# Altium schematic sheet Flight Controller Schematics.schdoc
size 315 x 259 mm
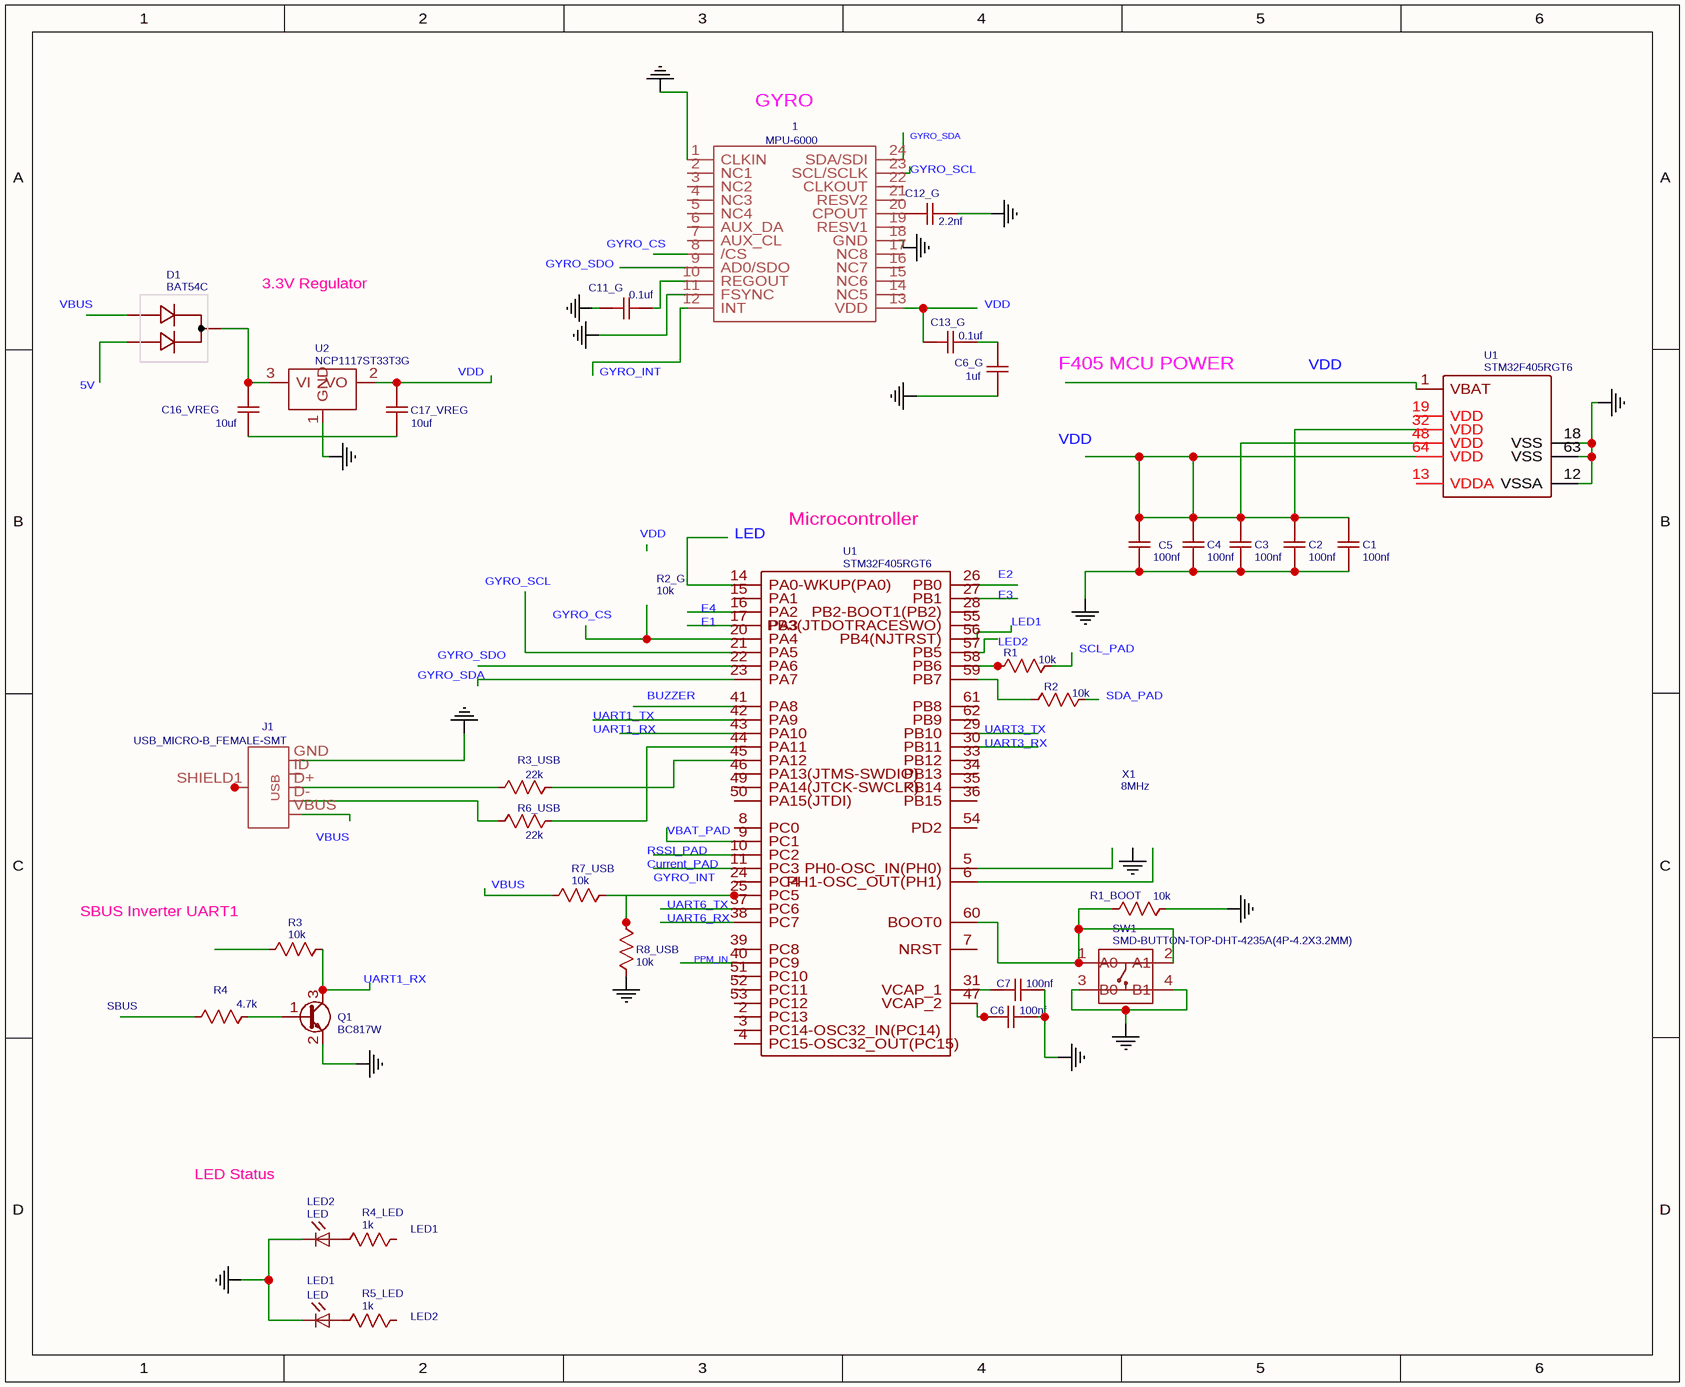
[diagram p0: Flight Controller Schematics.schdoc]

## Parts
(Parts that share a designator on the sheet are numbered #1, #2 ... from top to bottom, then left to right.)
1  MPU-6000  [QFN-24]
C1  100nf  [C0805]
C2  100nf  [C0805]
C3  100nf  [C0805]
C4  100nf  [C0805]
C5  100nf  [C0805]
C6  100nf  [C0805]
C6_G  1uf  [C0805]
C7  100nf  [C0805]
C11_G  0.1uf  [C0805]
C12_G  2.2nf  [C0805]
C13_G  0.1uf  [C0805]
C16_VREG  10uf  [C0805]
C17_VREG  10uf  [C0805]
D1  BAT54C  [SOT-23(SOT-23-3)]
J1  USB_MICRO-B_FEMALE-SMT  [USB-B-MICRO-SMD]
LED1  LED  [LED_CHIPLED_0805]
LED2  LED  [LED_CHIPLED_0805]
Q1  BC817W  [SOT-323_SC-70]
R1  10k  [R0402]
R1_BOOT  10k  [R0402]
R2  10k  [R0402]
R2_G  10k  [0402]
R3  10k  [R0402]
R3_USB  22k  [R0201]
R4  4.7k  [R0402]
R4_LED  1k  [R0402]
R5_LED  1k  [R0402]
R6_USB  22k  [R0201]
R7_USB  10k  [R0201]
R8_USB  10k  [R0201]
SW1  SMD-BUTTON-TOP-DHT-4235A(4P-4.2X3.2MM)  [SW4-SMD-4.2X3.2X2.5MM]
U1#1  STM32F405RGT6  [LQFP-64_L10.0-W10.0-P0.50-LS12.0-TL]
U1#2  STM32F405RGT6  [LQFP-64_L10.0-W10.0-P0.50-LS12.0-TL]
U2  NCP1117ST33T3G  [SOT223]
X1  8MHz  [3213]

## Nets
GND: 1.1(CLKIN) 1.11(FSYNC) 1.18(GND) C1.1 C2.1 C3.1 C4.1 C5.1 C6.2 C6_G.1 C7.2 C11_G.1 C12_G.2 J1.GND LED1.C LED2.C Q1.2(E) R1_BOOT.2 R8_USB.1 SW1.3(B0) SW1.4(B1) U1#1.12(VSSA) U1#1.18(VSS) U1#1.63(VSS) U2.1(GND)
Net1_10: 1.10(REGOUT) C11_G.2
Net1_13: 1.13(VDD) C13_G.1
Net1_20: 1.20(CPOUT) C12_G.1
NetC1_2: C1.2 C2.2 C3.2 C4.2 C5.2 U1#1.32(VDD) U1#1.48(VDD) U1#1.64(VDD)
NetC6_1: C6.1 U1#2.31(VCAP_1)
NetC6_G_2: C6_G.2 C13_G.2
NetC7_1: C7.1 U1#2.47(VCAP_2)
NetC16_VREG_1: C16_VREG.1 D1.3(K) U2.3(VI)
NetC16_VREG_2: C16_VREG.2 C17_VREG.2
NetC17_VREG_1: C17_VREG.1 U2.2(VO)
NetJ1_D+: J1.D+ R3_USB.1
NetJ1_D-: J1.D- R6_USB.1
NetJ1_SHIELD1: J1.SHIELD1(SHIELD) J1.SHIELD2(SHIELD) J1.SHIELD3(SHIELD)
NetLED1_A: LED1.A R5_LED.1
NetLED2_A: LED2.A R4_LED.1
NetQ1_1: Q1.1(B) R4.2
NetQ1_3: Q1.3(C) R3.1
NetR1_1: R1.1 U1#2.58(PB6)
NetR1_BOOT_1: R1_BOOT.1 SW1.1(A0) SW1.2(A1) U1#2.60(BOOT0)
NetR2_1: R2.1 U1#2.59(PB7)
NetR3_USB_2: R3_USB.2 U1#2.45(PA12)
NetR6_USB_2: R6_USB.2 U1#2.44(PA11)
NetR7_USB_2: R7_USB.2 R8_USB.2 U1#2.25(PC5)

Not connected (* = marked no-connect by the designer): 1 2(NC1) 3(NC2) 4(NC3) 5(NC4) 6(AUX_DA) 7(AUX_CL) 8(/CS) 9(AD0/SDO) 12(INT) 14(NC5) 15(NC6) 16(NC7) 17(NC8) 19(RESV1) 21(RESV2) 22(CLKOUT) 23(SCL/SCLK) 24(SDA/SDI); D1 1(A1) 2(A2); J1 ID VBUS; R1 2; R2 2; R3 2; R4 1; R4_LED 2; R5_LED 2; R7_USB 1; U1#1 1(VBAT) 13(VDDA) 19(VDD); U1#2 2(PC13) 3(PC14-OSC32_IN(PC14)) 4(PC15-OSC32_OUT(PC15)) 5(PH0-OSC_IN(PH0)) 6(PH1-OSC_OUT(PH1)) 7(NRST) 8(PC0) 9(PC1) 10(PC2) 11(PC3) 14(PA0-WKUP(PA0)) 15(PA1) 16(PA2) 17(PA3) 20(PA4) 21(PA5) 22(PA6) 23(PA7) 24(PC4) 26(PB0) 27(PB1) 28(PB2-BOOT1(PB2)) 29(PB10) 30(PB11) 33(PB12) 34(PB13) 35(PB14) 36(PB15) 37(PC6) 38(PC7) 39(PC8) 40(PC9) 41(PA8) 42(PA9) 43(PA10) 46(PA13(JTMS-SWDIO)) 49(PA14(JTCK-SWCLK)) 50(PA15(JTDI)) 51(PC10) 52(PC11) 53(PC12) 54(PD2) 55(PB3(JTDOTRACESWO)) 56(PB4(NJTRST)) 57(PB5) 61(PB8) 62(PB9)

## Notes on the sheet
- (near 1) GYRO
- GYRO_SCL
- (near 1) GYRO_SDA
- GYRO_CS
- VBUS
- 3.3V Regulator
- (near C11_G) GYRO_SDO
- VDD
- 5V
- GYRO_INT
- F405 MCU POWER
- Microcontroller
- (near R2_G) VDD
- (near U1#2) LED
- (near U1#2) E2
- E3
- GYRO_SDO
- E4
- E1
- (near R1) LED2
- (near R1) LED1
- SCL_PAD
- GYRO_SDA
- UART1_TX
- UART1_RX
- BUZZER
- UART3_TX
- (near R2) SDA_PAD
- UART3_RX
- (near J1) VBUS
- RSSI_PAD
- Current_PAD
- (near U1#2) VBAT_PAD
- SBUS Inverter UART1
- UART6_TX
- UART6_RX
- (near U1#2) PPM_IN
- SBUS
- LED Status
- (near R4_LED) LED1
- (near R5_LED) LED2
- Labels drawn without touching a wire or pin: GND
- (in symbol USB_MICRO-B_FEMALE-SMT) USB

## Library data of the parts
1 = MPU-6000: Contributor: praggu; spicePre: ?; spiceSymbolName: MPU-6000
C1-C7 = 100nf: nameAlias: Value(F); Contributor: LCEDA_Lib; spicePre: C; spiceSymbolName: C_0805_US
C6_G = 1uf: nameAlias: Value(F); Contributor: LCEDA_Lib; spicePre: C; spiceSymbolName: C_0805_US
C11_G C13_G = 0.1uf: nameAlias: Value(F); Contributor: LCEDA_Lib; spicePre: C; spiceSymbolName: C_0805_US
C12_G = 2.2nf: nameAlias: Value(F); Contributor: LCEDA_Lib; spicePre: C; spiceSymbolName: C_0805_US
C16_VREG C17_VREG = 10uf: nameAlias: Value(F); Contributor: LCEDA_Lib; spicePre: C; spiceSymbolName: C_0805_US
D1 = BAT54C: BOM_EasyEDA: C2135; BOM_Supplier Part: C2135; BOM_Supplier: EasyEDA; BOM_Manufacturer Part: BAT54C; spicePre: D; spiceSymbolName: BAT54C
J1 = USB_MICRO-B_FEMALE-SMT: Contributor: osirisizs; spicePre: J; spiceSymbolName: USB_MICRO-B_FEMALE-SMT
Q1 = BC817W: Contributor: aryehw; spicePre: Q; spiceSymbolName: BC817W
R1 R1_BOOT R2 R2_G R3 R7_USB R8_USB = 10k: nameAlias: Value(Ω); Contributor: LCEDA_Lib; spicePre: R
  R1 R1_BOOT R2 R2_G R3: spiceSymbolName: R_0402_US
  R7_USB R8_USB: spiceSymbolName: R_0201_US
R3_USB R6_USB = 22k: nameAlias: Value(Ω); Contributor: LCEDA_Lib; spicePre: R; spiceSymbolName: R_0201_US
R4 = 4.7k: nameAlias: Value(Ω); Contributor: LCEDA_Lib; spicePre: R; spiceSymbolName: R_0402_US
R4_LED R5_LED = 1k: nameAlias: Value(Ω); Contributor: LCEDA_Lib; spicePre: R; spiceSymbolName: R_0402_US
SW1 = SMD-BUTTON-TOP-DHT-4235A(4P-4.2X3.2MM): description: 311020045; spicePre: S; spiceSymbolName: SMD-BUTTON-TOP-DHT-4235A(4P-4.2X3.2MM)
U1#1 = STM32F405RGT6: BOM_Manufacturer: ST; subpart_no: 2; tags: STM32; BOM_Supplier Part: C15742; BOM_Supplier: LCSC; BOM_Manufacturer Part: STM32F405RGT6; image: http://image.lceda.cn/szlcsc/C15742.jpg; spicePre: U; spiceSymbolName: STM32F405RGT6
U1#2 = STM32F405RGT6: BOM_Manufacturer: ST; subpart_no: 1; tags: STM32; BOM_Supplier Part: C15742; BOM_Supplier: LCSC; BOM_Manufacturer Part: STM32F405RGT6; image: http://image.lceda.cn/szlcsc/C15742.jpg; spicePre: U; spiceSymbolName: STM32F405RGT6
X1 = 8MHz: BOM_Manufacturer Part: CSTCE8M00G52-R0; BOM_Manufacturer: MuRata; nameAlias: Frequency; BOM_Supplier: LCSC; BOM_Supplier Part: C22549; spicePre: X; spiceSymbolName: CSTCE8M00G52-R0 8MHz
LED1 LED2 = LED: description: LED; timeStamp: 1475049925; spicePre: L; spiceSymbolName: LED_LEDCHIPLED_0805
U2 = NCP1117ST33T3G: timeStamp: 1465876822; spicePre: U; spiceSymbolName: NCP1117ST33T3G